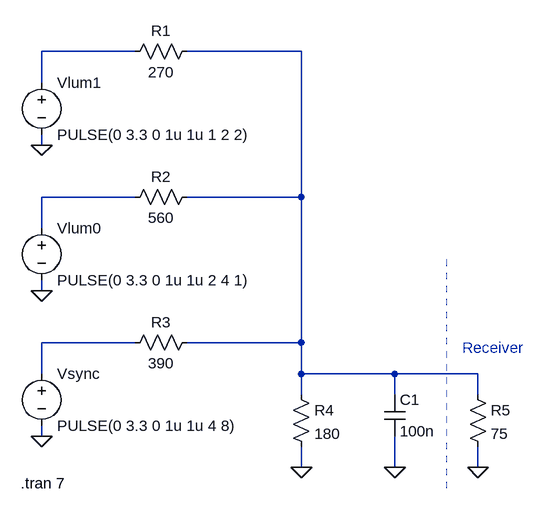
[diagram p0: schematic RS170.asc]
RS170.asc, the LTspice schematic file:
Version 4
SHEET 1 880 756
WIRE 208 48 64 48
WIRE 464 48 288 48
WIRE 64 96 64 48
WIRE 64 192 64 176
WIRE 208 272 64 272
WIRE 464 272 464 48
WIRE 464 272 288 272
WIRE 64 320 64 272
WIRE 64 416 64 400
WIRE 208 496 64 496
WIRE 464 496 464 272
WIRE 464 496 288 496
WIRE 64 544 64 496
WIRE 464 544 464 496
WIRE 608 544 464 544
WIRE 736 544 608 544
WIRE 464 576 464 544
WIRE 608 576 608 544
WIRE 736 576 736 544
WIRE 64 640 64 624
WIRE 464 688 464 656
WIRE 608 688 608 640
WIRE 736 688 736 656
FLAG 64 192 0
FLAG 64 416 0
FLAG 64 640 0
FLAG 464 688 0
FLAG 608 688 0
FLAG 736 688 0
SYMBOL voltage 64 80 R0
WINDOW 123 0 0 Left 0
WINDOW 39 0 0 Left 0
SYMATTR InstName Vlum1
SYMATTR Value PULSE(0 3.3 0 1u 1u 1 2 2)
SYMBOL res 304 32 R90
WINDOW 0 0 56 VBottom 2
WINDOW 3 32 56 VTop 2
SYMATTR InstName R1
SYMATTR Value 270
SYMBOL voltage 64 304 R0
WINDOW 123 0 0 Left 0
WINDOW 39 0 0 Left 0
SYMATTR InstName Vlum0
SYMATTR Value PULSE(0 3.3 0 1u 1u 2 4 1)
SYMBOL res 304 256 R90
WINDOW 0 0 56 VBottom 2
WINDOW 3 32 56 VTop 2
SYMATTR InstName R2
SYMATTR Value 560
SYMBOL voltage 64 528 R0
WINDOW 123 0 0 Left 0
WINDOW 39 0 0 Left 0
SYMATTR InstName Vsync
SYMATTR Value PULSE(0 3.3 0 1u 1u 4 8)
SYMBOL res 304 480 R90
WINDOW 0 0 56 VBottom 2
WINDOW 3 32 56 VTop 2
SYMATTR InstName R3
SYMATTR Value 390
SYMBOL res 448 560 R0
SYMATTR InstName R4
SYMATTR Value 180
SYMBOL cap 592 576 R0
SYMATTR InstName C1
SYMATTR Value 100n
SYMBOL res 720 560 R0
SYMATTR InstName R5
SYMATTR Value 75
TEXT 32 712 Left 2 !.tran 7
TEXT 712 504 Left 2 ;Receiver
LINE Normal 688 720 688 368 2

The netlist it stands for:
* RS170.asc
Vlum1 N001 0 PULSE(0 3.3 0 1u 1u 1 2 2)
R1 N002 N001 270
Vlum0 N003 0 PULSE(0 3.3 0 1u 1u 2 4 1)
R2 N002 N003 560
Vsync N004 0 PULSE(0 3.3 0 1u 1u 4 8)
R3 N002 N004 390
R4 N002 0 180
C1 N002 0 100n
R5 N002 0 75
.tran 7
* Receiver
.backanno
.end